# EAGLE design LabPower-FB_MC (EAGLE 8.0.1)

## Sheet 1 of 2: FB
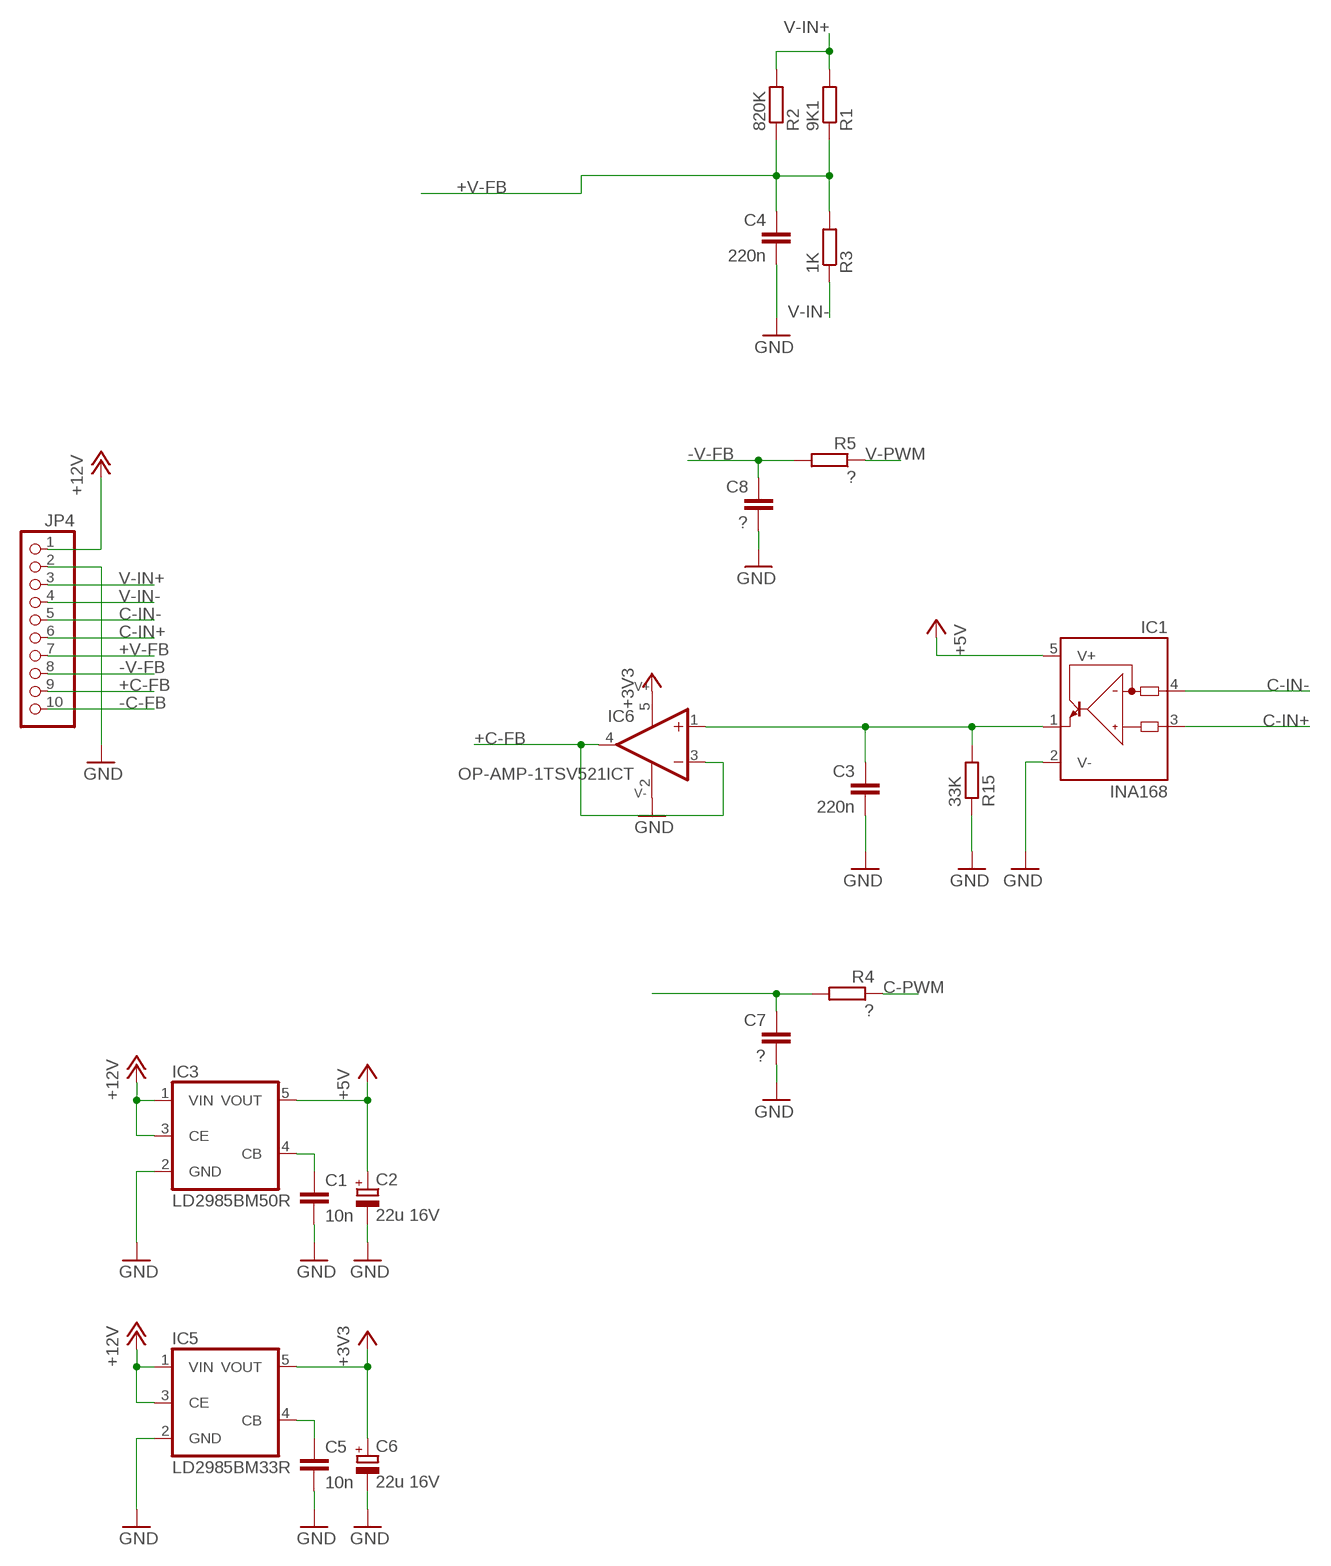
[diagram p0: schematic, sheet 1]

### Parts
C1  10n  C-EUC0805  [C0805]
C2  22u 16V  CPOL-EUB/3528-21W  [B/3528-21W]
C3  220n  CAP_0805  [C0805]
C4  220n  CAP_0805  [C0805]
C5  10n  C-EUC0805  [C0805]
C6  22u 16V  CPOL-EUB/3528-21W  [B/3528-21W]
C7  ?  CAP_0805  [C0805]
C8  ?  CAP_0805  [C0805]
IC1  INA168  [SOT23-5]
IC3  LD2985BM50R  TS5205  [SOT25]
IC5  LD2985BM33R  TS5205  [SOT25]
IC6  OP-AMP-1TSV521ICT  [SC70-5L]
JP4  PINHD-1X10/90  [1X10/90]
R1  9K1  R-EU_R0805  [R0805]
R2  820K  R-EU_R0805  [R0805]
R3  1K  R-EU_R0805  [R0805]
R4  ?  R_0805  [R0805]
R5  ?  R_0805  [R0805]
R15  33K  R-EU_R0805  [R0805]

### Nets
+3V3: C6.+ IC5.5(VOUT) IC6.5(V+) ; also sheet 2
+5V: C2.+ IC1.5(V+) IC3.5(VOUT)
+12V: IC3.1(VIN) IC3.3(CE) IC5.1(VIN) IC5.3(CE) JP4.1
+C-FB: IC6.3(-IN) IC6.4(OUT) JP4.9 ; also sheet 2
+V-FB: C4.1 JP4.7 R1.1 R2.1 R3.2 ; also sheet 2
-C-FB: C7.1 JP4.10 R4.2
-V-FB: C8.1 JP4.8 R5.2
C-IN+: IC1.3(IN+) JP4.6
C-IN-: IC1.4(IN-) JP4.5
C-PWM: R4.1 ; also sheet 2
GND: C1.2 C2.- C3.2 C4.2 C5.2 C6.- C7.2 C8.2 IC1.2(V-) IC3.2(GND) IC5.2(GND) IC6.2(V-) JP4.2 R15.1 ; also sheet 2
N$1: C5.1 IC5.4(CB)
N$3: C3.1 IC1.1(OUT) IC6.1(+IN) R15.2
N$5: C1.1 IC3.4(CB)
V-IN+: JP4.3 R1.2 R2.2
V-IN-: JP4.4 R3.1
V-PWM: R5.1 ; also sheet 2

## Sheet 2 of 2
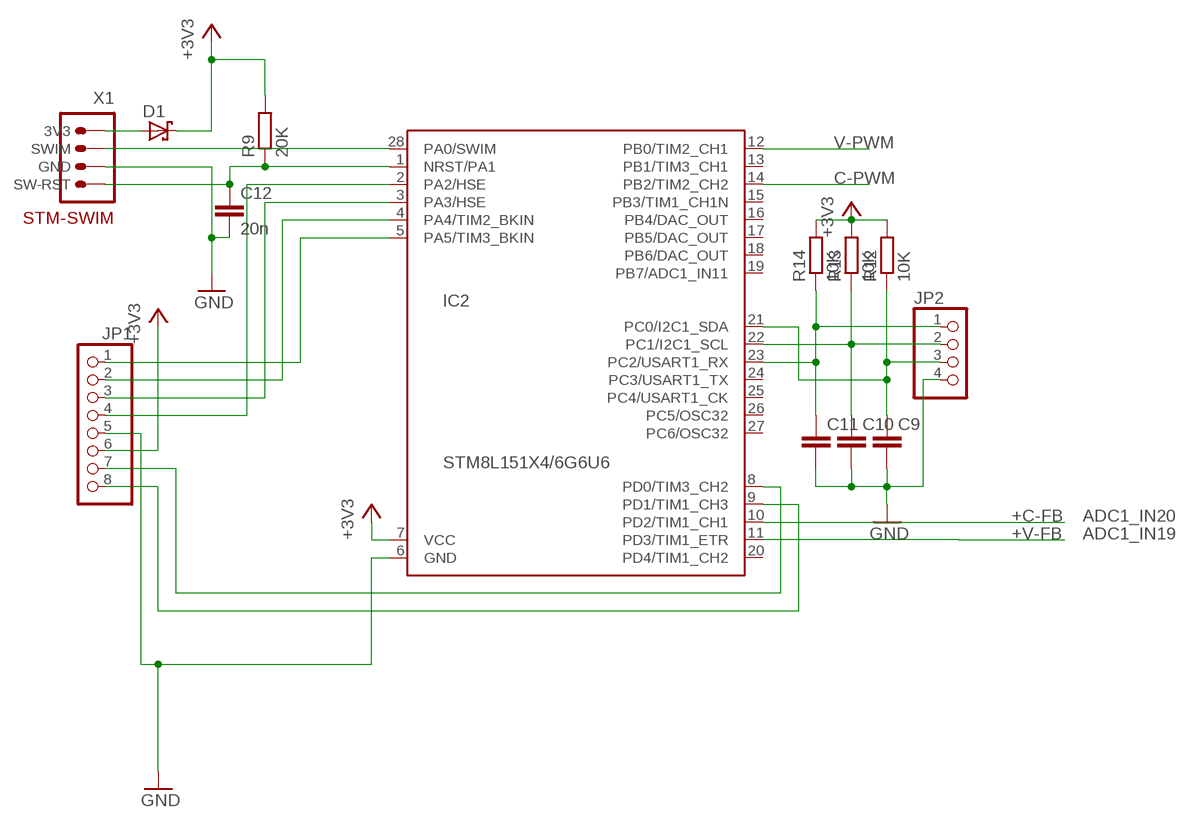
[diagram p1: schematic, sheet 2]

### Parts
C9  CAP_0805  [C0805]
C10  CAP_0805  [C0805]
C11  CAP_0805  [C0805]
C12  20n  CAP_0805  [C0805]
D1  DIODE-SH_SOD523  [SOD523]
IC2  STM8L151X4/6G6U6  [QFN28]
JP1  PINHD-1X8  [1X08]
JP2  PINHD-1X4  [1X04]
R9  20K  R_0805  [R0805]
R12  10K  R_0805  [R0805]
R13  10K  R_0805  [R0805]
R14  10K  R_0805  [R0805]
X1  STM-SWIMPINS  [1X04/90]

### Nets
+3V3: D1.C IC2.7(VCC) JP1.6 R9.2 R12.2 R13.2 R14.2 ; also sheet 1
+C-FB: IC2.10(PD2/TIM1_CH1) ; also sheet 1
+V-FB: IC2.11(PD3/TIM1_ETR) ; also sheet 1
C-PWM: IC2.14(PB2/TIM2_CH2) ; also sheet 1
GND: C9.2 C10.2 C11.2 C12.2 IC2.6(GND) JP1.5 JP2.4 X1.3(GND) ; also sheet 1
N$2: IC2.28(PA0/SWIM) X1.2(SWIM)
N$7: C12.1 IC2.1(NRST/PA1) R9.1 X1.4(SW-RST)
N$8: IC2.2(PA2/HSE) JP1.4
N$9: D1.A X1.1(3V3)
N$10: IC2.3(PA3/HSE) JP1.3
N$12: IC2.4(PA4/TIM2_BKIN) JP1.2
N$13: IC2.5(PA5/TIM3_BKIN) JP1.1
N$14: C11.1 IC2.23(PC2/USART1_RX) JP2.1 R14.1
N$15: C10.1 IC2.22(PC1/I2C1_SCL) JP2.2 R13.1
N$16: IC2.8(PD0/TIM3_CH2) JP1.7
N$17: IC2.9(PD1/TIM1_CH3) JP1.8
N$18: C9.1 IC2.21(PC0/I2C1_SDA) JP2.3 R12.1
V-PWM: IC2.12(PB0/TIM2_CH1) ; also sheet 1
Unconnected: IC2.13(PB1/TIM3_CH1) IC2.15(PB3/TIM1_CH1N) IC2.16(PB4/DAC_OUT) IC2.17(PB5/DAC_OUT) IC2.18(PB6/DAC_OUT) IC2.19(PB7/ADC1_IN11) IC2.20(PD4/TIM1_CH2) IC2.24(PC3/USART1_TX) IC2.25(PC4/USART1_CK) IC2.26(PC5/OSC32) IC2.27(PC6/OSC32)

### Notes on the sheet
- ADC1_IN20
- ADC1_IN19

## Library data of the parts
C1 C5 = rcl:C-EU: CAPACITOR, European symbol
C2 C6 = rcl:CPOL-EU: POLARIZED CAPACITOR, European symbol
C3 C4 C7-C12 = Namenlos:CAP_
D1 = Namenlos:DIODE-SH_
IC1 = burr-brown:INA168: High-Side Measurement Current Shunt Monitor; MF: TEXAS INSTRUMENTS; MPN: INA168NA/250; OC_FARNELL: 4375737; OC_NEWARK: 35C1744
IC2 = Namenlos:STM8L151X4/6
IC3 IC5 = v-reg:TS5205: 150mA Low Noise LDO Voltage Regulator with Enable TSC [Taiwan Semiconductor Company, Ltd] Source: http://www.taiwansemi.com .. 5205_0409c.pdf
IC6 = Namenlos:OP-AMP-1
JP1 = pinhead:PINHD-1X8: PIN HEADER
JP2 = pinhead:PINHD-1X4: PIN HEADER
JP4 = pinhead:PINHD-1X10: PIN HEADER
R1-R3 R15 = rcl:R-EU_: RESISTOR, European symbol
R4 R5 R9 R12-R14 = Namenlos:R_
X1 = Namenlos:STM-SWIM

## Net classes
0 default: clearance 0.205 mm

## Board
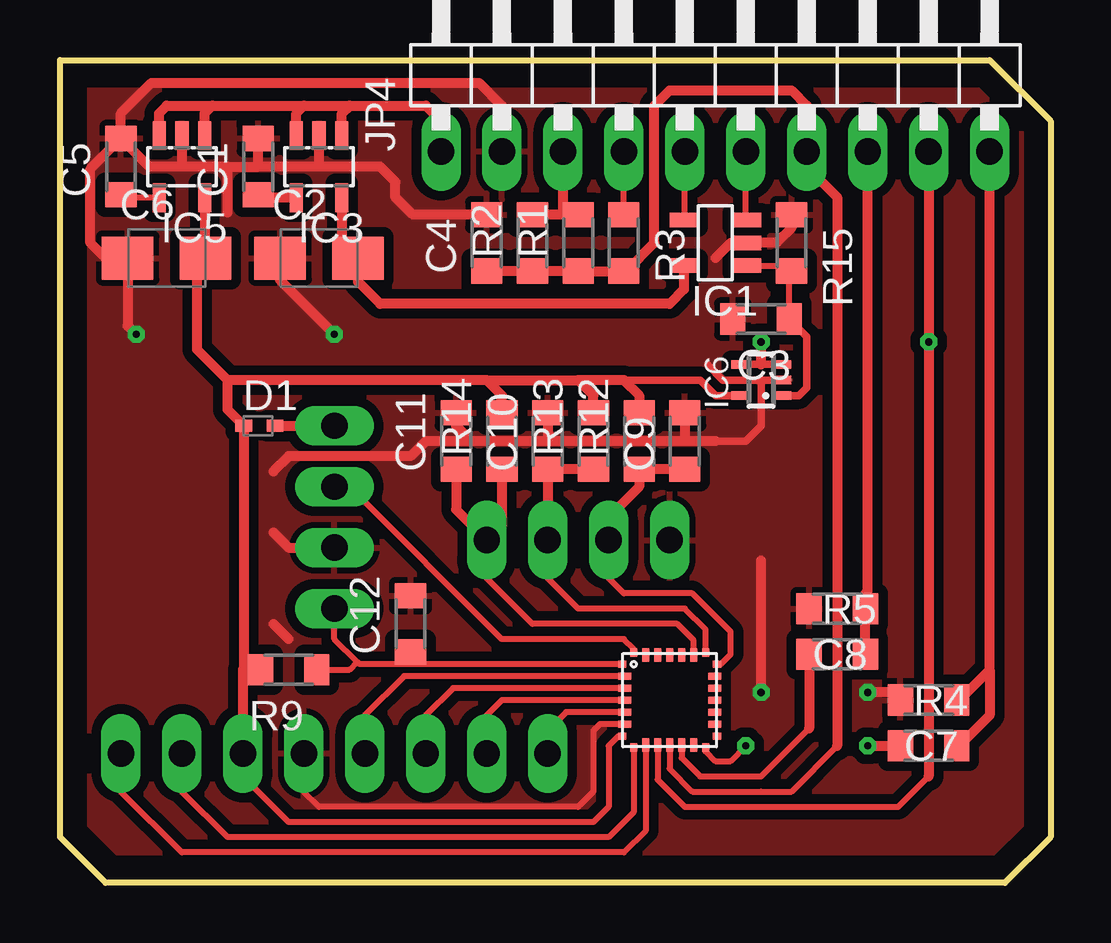
[diagram p2: board, top side]
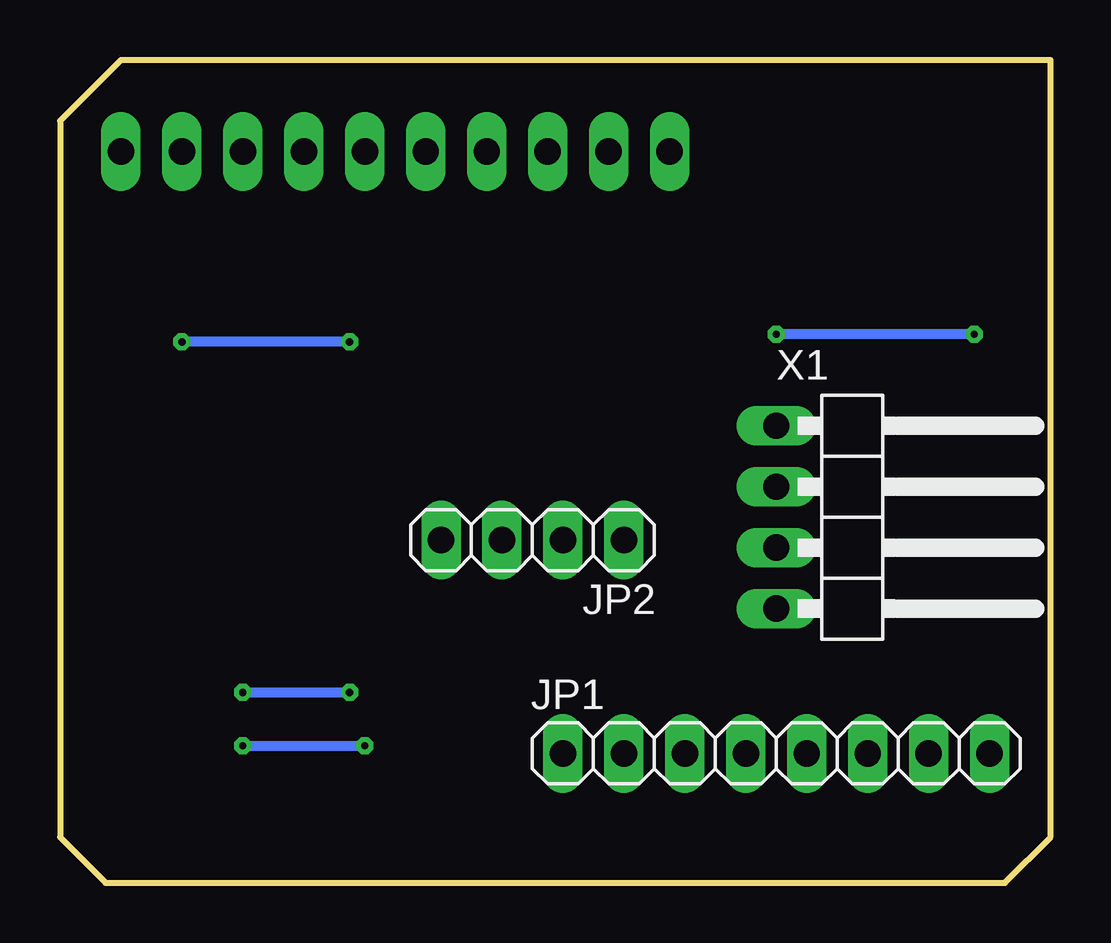
[diagram p3: board, bottom side, seen from below]

Size 41.27 x 34.29 mm. Coordinates in mm from the lower left corner, seen from the top.
Outline: 0,34.29 38.73,34.29 41.27,31.75 41.27,1.91 39.37,0 1.91,0 0,1.91 0,34.29
Copper layers (1*16): Top 0.035mm / dielectric 1.5mm / Bottom 0.035mm
Design rules "EagleDesignRules": minimum track width 0.2mm, minimum drill 0.3mm, track to track 0.2mm, track to pad 0.2mm, pad to pad 0.2mm, via to via 0.2mm, smd to smd 0.2mm, copper to edge 1mm, drill to drill 0.2mm, minimum pad ring 10mil, minimum via ring 8mil, stop-mask expansion 4mil, vias tented up to drill 0mil, thermal gap 0.25mm

### Footprints (pad centres in the part's own frame; a part is rotated, then mirrored left to right if it is on the bottom)
C0805 = smd 1.05 x 1.3: 1 -1.175,0; 2 1.175,0
B/3528-21W = smd 2.15 x 1.8: + 1.625,0; - -1.625,0
SOD523 = smd 0.7 x 0.5: A 0.7,0; C -0.6,0
SOT23-5 = smd 0.6 x 1.2: 1 -0.95,-1.306; 2 0,-1.306; 3 0.95,-1.306; 4 0.95,1.306; 5 -0.95,1.306
QFN28 = smd 0.35 x 0.29: 1 -1.975,1.5; 7 -1.975,-1.5; 15 1.975,-1.5; 21 1.975,1.5 | smd 0.55 x 0.29: 2 -1.875,1; 3 -1.875,0.5; 4 -1.875,0; 5 -1.875,-0.5; 6 -1.875,-1; 16 1.875,-1; 17 1.875,-0.5; 18 1.875,0; 19 1.875,0.5; 20 1.875,1 | smd 0.29 x 0.35: 8 -1.5,-1.975; 14 1.5,-1.975; 22 1.5,1.975; 28 -1.5,1.975 | smd 0.29 x 0.55: 9 -1,-1.875; 10 -0.5,-1.875; 11 0,-1.875; 12 0.5,-1.875; 13 1,-1.875; 23 1,1.875; 24 0.5,1.875; 25 0,1.875; 26 -0.5,1.875; 27 -1,1.875
SOT25 = smd 0.55 x 1.2: 1 -0.95,-1.3; 2 0,-1.3; 3 0.95,-1.3; 4 0.95,1.3; 5 -0.95,1.3
SC70-5L = smd 0.35 x 0.8: 1 -0.65,-0.85; 2 0,-0.85; 3 0.65,-0.85; 4 0.65,0.85; 5 -0.65,0.85
1X08 = drill 1.1 pad 1.422 long: 1 -8.89,0; 2 -6.35,0; 3 -3.81,0; 4 -1.27,0; 5 1.27,0; 6 3.81,0; 7 6.35,0; 8 8.89,0
1X04 = drill 1.1 pad 1.422 long: 1 -3.81,0; 2 -1.27,0; 3 1.27,0; 4 3.81,0
1X10/90 = drill 1.1 long: 1 -11.43,-3.81; 2 -8.89,-3.81; 3 -6.35,-3.81; 4 -3.81,-3.81; 5 -1.27,-3.81; 6 1.27,-3.81; 7 3.81,-3.81; 8 6.35,-3.81; 9 8.89,-3.81; 10 11.43,-3.81
R0805 = smd 1.05 x 1.3: 1 -1.175,0; 2 1.175,0
1X04/90 = drill 1.1 long: 1 -3.81,-3.81; 2 -1.27,-3.81; 3 1.27,-3.81; 4 3.81,-3.81

### Placement (x,y rotation side)
C1  8.26,29.84 90 top
C2  10.8,26.03 0 top
C3  29.21,23.49 180 top
C4  17.78,26.67 90 top
C5  2.54,29.84 90 top
C6  4.45,26.03 0 top
C7  36.2,7.62 180 top
C8  32.39,11.43 180 top
C9  26.04,18.41 90 top
C10  20.32,18.41 90 top
C11  16.51,18.41 90 top
C12  14.61,10.79 90 top
D1  8.26,19.05 0 top
IC1  27.3,26.67 90 top
IC2  25.4,7.62 0 top
IC3  10.8,29.84 180 top
IC5  5.08,29.84 180 top
IC6  29.21,20.95 90 top
JP1  11.43,5.4 0 bottom
JP2  21.59,14.29 180 bottom
JP4  27.3,34.29 0 top
R1  21.59,26.67 90 top
R2  19.69,26.67 90 top
R3  23.5,26.67 270 top
R4  36.2,5.71 0 top
R5  32.39,9.52 0 top
R9  9.52,8.89 180 top
R12  24.13,18.41 90 top
R13  22.23,18.41 90 top
R14  18.42,18.41 90 top
R15  30.48,26.67 270 top
X1  7.62,15.24 270 bottom

### Tracks (layer width: path | path; a pad name or v marks a point on that pad's centre or on a via)
+3V3
  Top 0.254: JP1.6 7.62,4.45 9.52,2.54 22.23,2.54 22.86,3.18 22.86,5.71 23.27,6.12 IC2.7 | 6.07,28.5 IC5.5 | C6.+ 5.72,25.68
  Top 0.305: IC6.5 27.32,20.3 26.67,20.95 23.5,20.95
  Top 0.406: R14.2 18.42,20.32 17.78,20.95 | 21.59,20.95 23.5,20.95 24.13,20.32 R12.2 | R13.2 22.23,20.32 21.59,20.95 | 6.98,20.95 5.72,22.23 5.72,25.68 | 17.78,20.95 21.59,20.95 | 17.78,20.95 6.98,20.95 | 6.98,20.95 6.98,19.72 D1.C 7.66,8.93 7.62,8.89 | 7.62,8.89 JP1.6 | R9.2 7.62,8.89 | IC5.5 6.03,26.07 C6.+
+5V
  Top 0.254: 12.7,25.75 C2.+ 12.07,25.68
  Top 0.406: IC3.5 11.75,26.71 C2.+ 12.42,25.05 13.34,24.13 25.4,24.13 26,24.73 IC1.5
+12V
  Top 0.406: IC3.1 11.75,32.06 12.07,32.38 | 12.07,32.38 15.24,32.38 15.88,31.75 JP4.1 | IC3.3 9.84,32.07 10.16,32.38 | 10.16,32.38 12.07,32.38 | IC5.1 6.03,32.06 6.35,32.38 | 6.35,32.38 10.16,32.38 | IC5.3 4.13,32.07 4.45,32.38 6.35,32.38
+C-FB  (via drill 0.3)
  Top 0.254: 36.2,4.45 34.93,3.18 28.58,3.18 26.04,3.18 24.9,4.31 IC2.10
  Top 0.305: IC6.4 29.21,21.6 IC6.3
  Top 0.406: JP4.9 v36.2,22.54 36.2,4.45 | 29.21,21.6 v29.21,22.54
  Bottom 0.406: v29.21,22.54 v36.2,22.54
+V-FB
  Top 0.254: 32.39,5.71 30.48,3.81 29.21,3.81 26.35,3.81 25.4,4.76 IC2.11
  Top 0.406: C4.1 R2.1 R1.1 R3.2 23.59,25.49 24.77,26.67 24.77,32.38 25.4,33.02 30.48,33.02 31.12,32.38 JP4.7 31.12,29.84 32.39,28.57 32.39,5.71
-C-FB
  Top 0.406: 38.73,8.89 38.73,6.98 37.47,5.71 R4.2 | 38.73,8.89 JP4.10 | C7.1 37.47,7.62 38.73,8.89
-V-FB
  Top 0.406: JP4.8 33.66,12.16 33.56,12.06 C8.1 R5.2
C-IN+
  Top 0.254: IC1.3 28.58,27.66 JP4.6
C-IN-
  Top 0.254: IC1.4 26.04,27.66 JP4.5
C-PWM  (via drill 0.3)
  Top 0.254: v28.58,5.71 27.94,5.08 27.3,5.08 26.9,5.48 IC2.14
  Top 0.406: v33.66,5.71 R4.1
  Bottom 0.406: v33.66,5.71 v28.58,5.71
GND  (via drill 0.3)
  Top 0.254: 9.52,26.03 C2.- | 3.18,26.03 C6.- | IC2.6 22.5,6.62 22.23,6.35 22.23,3.81 21.59,3.18 10.8,3.18 10.16,3.81 JP1.5
  Top 0.305: 27.3,18.41 28.58,18.41 29.21,19.05 29.21,20.95 | 29.21,20.95 IC6.2 | 29.21,20.95 27.62,20.95 26.99,21.59
  Top 0.406: C5.2 2.54,32.07 3.81,33.34 17.46,33.34 18.42,32.38 JP4.2 | 8.26,29.84 C1.2 | 6.98,29.84 5.08,29.84 | 6.98,29.84 8.26,29.84 | 5.08,29.84 3.72,29.84 C5.2 | IC5.2 5.08,29.84 | 10.8,29.84 IC3.2 | 10.8,29.84 8.26,29.84 | C4.2 14.7,27.84 13.97,28.57 13.97,29.21 13.34,29.84 10.8,29.84 | C5.2 1.27,29.75 1.27,26.67 1.91,26.03 C6.- 2.82,23.21 v3.18,22.86 | 8.89,26.03 C2.- 9.17,25.12 v11.43,22.86 | 6.98,27.94 6.98,29.84 | 27.3,26.03 27.94,26.67 IC1.2 29.85,26.67 30.48,27.3 R15.1 | C11.2 16.51,19.05 17.15,18.41 | 20.32,18.41 17.15,18.41 | 26.04,18.41 20.32,18.41 | 27.3,18.41 26.04,18.41 | C10.2 20.32,18.41 | C9.2 26.04,18.41 | 17.15,18.41 15.24,18.41 14.61,17.78 9.52,17.78 8.89,17.14 | 8.89,14.61 9.52,13.97 X1.3 | 9.52,10.16 8.89,10.79 | JP2.4 25.72,14.29 | C7.2 34.7,7.94 v33.66,7.94 | v29.21,7.94 29.21,13.43
  Bottom 0.406: v33.66,7.94 v29.21,7.94 | v3.18,22.86 v11.43,22.86
  pour Top (isolate 0.406): 0,1.91 1.91,0 39.37,0 41.27,1.91 41.27,31.75 38.73,34.29 0,34.29
N$1
  Top 0.254: IC5.4 2.66,28.54 C5.1
N$2
  Top 0.254: IC2.28 23.9,9.75 23.5,10.16 18.42,10.16 12.07,16.51 X1.2
N$3
  Top 0.254: IC1.1 30.26,25.72 R15.2 30.39,25.4 C3.1
  Top 0.305: IC6.1 30.78,20.3 31.12,20.64 31.12,22.77 C3.1
N$4
  cutout Top: 27.3,9.52 23.5,9.52 23.5,5.71 27.3,5.71
N$5
  Top 0.406: IC3.4 8.38,28.54 C1.1
N$7
  Top 0.254: IC2.1 14.61,9.12 | 14.61,9.12 12.47,9.12 12.38,9.21 | 12.38,9.21 11.43,10.16 X1.4 | C12.1 14.61,9.12 | R9.1 12.07,8.89 12.38,9.21
N$8
  Top 0.254: IC2.2 14.34,8.62 12.7,6.98 JP1.4
N$9
  Top 0.406: D1.A X1.1
N$10
  Top 0.254: IC2.3 16.38,8.12 15.24,6.98 JP1.3
N$12
  Top 0.254: IC2.4 18.42,7.62 17.78,6.98 JP1.2
N$13
  Top 0.254: IC2.5 21.09,7.12 20.32,6.35 JP1.1
N$14
  Top 0.254: IC2.23 26.4,10.11 25.72,10.79 19.69,10.79 17.78,12.7 JP2.1
  Top 0.406: C11.1 16.51,15.56 JP2.1 18.42,14.92 R14.1
N$15
  Top 0.254: IC2.22 26.9,10.56 26.04,11.43 21.59,11.43 20.32,12.7 JP2.2
  Top 0.406: JP2.2 C10.1 R13.1
N$16
  Top 0.254: IC2.8 23.9,2.95 22.86,1.91 6.98,1.91 5.08,3.81 JP1.7
N$17
  Top 0.254: IC2.9 24.4,2.17 23.5,1.27 5.08,1.27 2.54,3.81 JP1.8
N$18
  Top 0.254: IC2.21 27.54,9.12 27.94,9.52 27.94,10.48 26.35,12.06 23.5,12.06 22.86,12.7 22.86,13.97 JP2.3
  Top 0.406: 22.86,13.97 22.86,15.24 24.13,16.51 R12.1 C9.1
V-IN+
  Top 0.254: R2.2 20.23,27.84
  Top 0.406: 20.96,27.84 R1.2 | 20.96,27.84 R2.2 | JP4.3 20.96,27.84
V-IN-
  Top 0.254: R3.1 JP4.4
V-PWM
  Top 0.254: 31.21,6.45 29.21,4.45 26.67,4.45 25.9,5.21 IC2.12
  Top 0.406: R5.1 31.21,6.45